# Altium schematic sheet LED Dice.SchDoc
size A; SheetNumber: 1; SheetTotal: 2
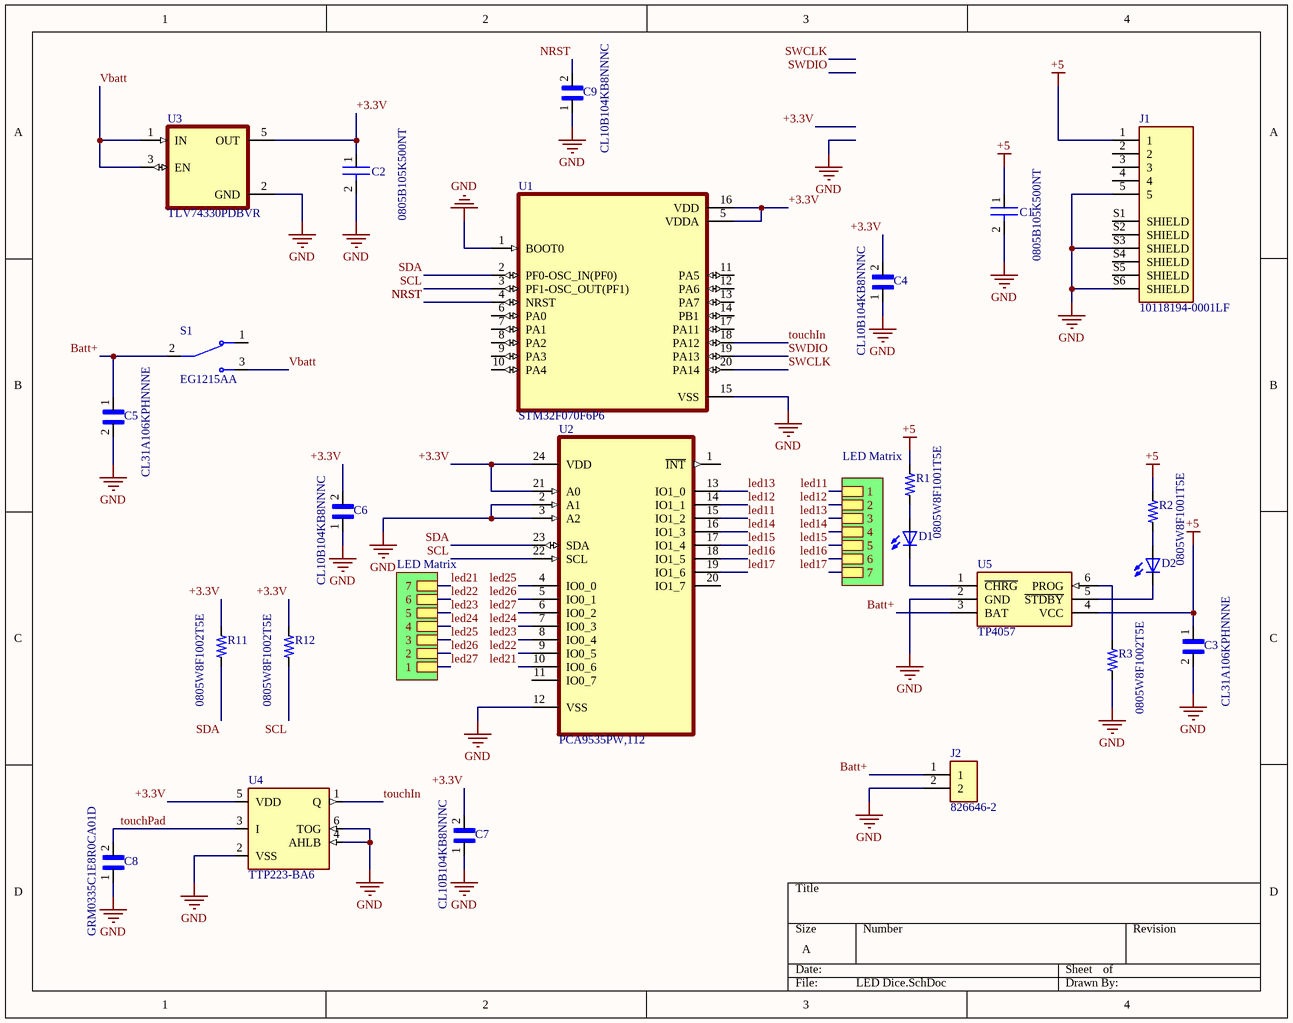
[diagram p0: LED Dice.SchDoc]

## Parts
C1  0805B105K500NT  [CAPC2012X135N]
C2  0805B105K500NT  [CAPC2012X135N]
C3  CL31A106KPHNNNE  [CAPC3216X180N]
C4  CL10B104KB8NNNC  [CAPC1608X90N]
C5  CL31A106KPHNNNE  [CAPC3216X180N]
C6  CL10B104KB8NNNC  [CAPC1608X90N]
C7  CL10B104KB8NNNC  [CAPC1608X90N]
C8  GRM0335C1E8R0CA01D  [CAPC1608X90N]
C9  CL10B104KB8NNNC  [CAPC1608X90N]
D1  LTST-C171KRKT  [DIOC200X125X110]  (value not drawn)
D2  LTST-C171KRKT  [DIOC200X125X110]  (value not drawn)
J1  10118194-0001LF  [AMPHENOL_10118194-0001LF]
J2  826646-2  [TE_826646-2]
R1  0805W8F1001T5E  [RESC2012X65N]
R2  0805W8F1001T5E  [RESC2012X65N]
R3  0805W8F1002T5E  [RESC2012X65N]
R11  0805W8F1002T5E  [RESC2012X65N]
R12  0805W8F1002T5E  [RESC2012X65N]
S1  EG1215AA  [SW_EG1215AA]
U1  STM32F070F6P6  [SOP65P640X120-20N]
U2  PCA9535PW,112  [SOP65P640X110-24N]
U3  TLV74330PDBVR  [SOT95P280X145-5N]
U4  TTP223-BA6  [SOT23-6]
U5  TP4057  [SOT23-6]

## Sub-sheets
LED Matrix = LED Matrix.SchDoc: 1, 2, 3, 4, 5, 6, 7
LED Matrix = LED Matrix.SchDoc: 1, 2, 3, 4, 5, 6, 7

## Nets
+5: C1.1(A) C3.1 J1.1 R1.2 R2.2 U5.4(VCC)
GND: C1.2(C) C2.2(C) C3.2 C4.1 C5.2 C6.1 C7.1 C8.1 C9.1 J1.5 J1.S3(SHIELD) J1.S6(SHIELD) J2.2 R3.1 U1.1(BOOT0) U1.15(VSS) U2.2(A1) U2.3(A2) U2.12(VSS) U3.2(GND) U4.2(VSS) U4.4(AHLB) U4.6(TOG) U5.2(GND)
+3.3V: C2.1(A) C4.2 C6.2 C7.2 R11.2 R12.2 U1.5(VDDA) U1.16(VDD) U2.21(A0) U2.24(VDD) U3.5(OUT) U4.5(VDD)
Batt+: C5.1 J2.1 S1.2 U5.3(BAT)
led11: U2.15(IO1_2) ; sheet LED Matrix/1
led12: U2.14(IO1_1) ; sheet LED Matrix/2
led13: U2.13(IO1_0) ; sheet LED Matrix/3
led14: U2.16(IO1_3) ; sheet LED Matrix/4
led15: U2.17(IO1_4) ; sheet LED Matrix/5
led16: U2.18(IO1_5) ; sheet LED Matrix/6
led17: U2.19(IO1_6) ; sheet LED Matrix/7
led21: U2.10(IO0_6) ; sheet LED Matrix/7
led22: U2.9(IO0_5) ; sheet LED Matrix/6
led23: U2.8(IO0_4) ; sheet LED Matrix/5
led24: U2.7(IO0_3) ; sheet LED Matrix/4
led25: U2.4(IO0_0) ; sheet LED Matrix/3
led26: U2.5(IO0_1) ; sheet LED Matrix/2
led27: U2.6(IO0_2) ; sheet LED Matrix/1
NRST: C9.2 U1.4(NRST)
SCL: R12.1 U1.3(PF1-OSC_OUT(PF1)) U2.22(SCL)
SDA: R11.1 U1.2(PF0-OSC_IN(PF0)) U2.23(SDA)
SWCLK: U1.20(PA14)
SWDIO: U1.19(PA13)
touchIn: U1.18(PA12) U4.1(Q)
touchPad: C8.2 U4.3(I)
Vbatt: S1.3 U3.1(IN) U3.3(EN)
NetD1_NEG: D1.NEG U5.1(~{CHRG})
NetD1_POS: D1.POS R1.1
NetD2_NEG: D2.NEG U5.5(~{STDBY})
NetD2_POS: D2.POS R2.1
NetR3_2: R3.2 U5.6(PROG)

Not connected (* = marked no-connect by the designer): J1 2 3 4 S1(SHIELD) S2(SHIELD) S4(SHIELD) S5(SHIELD); S1 1; U1 6(PA0) 7(PA1) 8(PA2) 9(PA3) 10(PA4) 11(PA5) 12(PA6) 13(PA7) 14(PB1) 17(PA11); U2 1(~{INT}) 11(IO0_7) 20(IO1_7)

## Library data of the parts
C1 C2 = 0805B105K500NT: 50V 1uF X7R ±10% 0805 Multilayer Ceramic Capacitors MLCC - SMD/SMT ROHS
C3 C5 = CL31A106KPHNNNE: Cap Ceramic 10uF 10VDC X5R 10% SMD 1206 Embossed T/R; Package: None; Price: None; Value: *; MP: CL31A106KPHNNNE; Availability: Unavailable
C4 C6 C7 C9 = CL10B104KB8NNNC: 0.1ÂµF Â±10% 50V Ceramic Capacitor X7R 0603 _1608 Metric_; MF: Samsung Electro-Mechanics; Price: None; MP: CL10B104KB8NNNC; SnapEDA_Link: https://www.snapeda.com/parts/CL10B104KB8NNNC/Samsung%20Electro-Mechanics/view-part/3598309/?ref=snap; Availability: Unavailable; Package: 0603 Samsung; Value: *
C8 = GRM0335C1E8R0CA01D: SMD Capacitor C0G(EIA) with Capacitance: 8.0pF Tol. 0.25pF. Rated Voltage: 25Vdc; Package: None; Price: None; Value: *; MP: GRM0335C1E8R0CA01D; Availability: Unavailable
D1 D2 = LTST-C171KRKT: Red LED  0805 _2012 Indication 631nm - Discrete 2V 0805 _2012 Metric_; MF: Lite-On Inc.; MP: LTST-C171KRKT; Package: 0805 Lite-On; Price: None; Availability: Unavailable; SnapEDA_Link: https://www.snapeda.com/parts/LTST-C171KRKT/Lite-On%20Inc./view-part/357775/?ref=snap; Value: *
J1 = 10118194-0001LF: Micro USB, Input Output Connectors, B TYPE RECEPTACLE with flange; MF: Amphenol ICC; Package: None; Price: None; Check_prices: https://www.snapeda.com/parts/10118194-0001LF/Amphenol+FCI/view-part/?ref=eda; Value: *; SnapEDA_Link: https://www.snapeda.com/parts/10118194-0001LF/Amphenol+FCI/view-part/?ref=snap; MP: 10118194-0001LF; Availability: In Stock; Purchase-URL: https://pricing.snapeda.com/search/part/10118194-0001LF/?ref=eda
J2 = 826646-2: Conn Unshrouded Header HDR 2 POS 2.54mm Solder ST Thru-Hole; Centerline_Pitch: 2.54 mm[.1 in]; Product_Type: Connector; MF: TE Connectivity; Number_of_Positions: 2; Availability: Good; Price: None; EU_RoHS_Compliance: Compliant; Value: *; DigiKey-Purchase-URL: https://snapeda.com/shop?store=DigiKey&id=470405; Mouser-Purchase-URL: https://snapeda.com/shop?store=Mouser&id=470405; SnapEDA_Link: https://www.snapeda.com/parts/826646-2/TE%20Connectivity%20AMP%20Connectors/view-part/470405/?ref=snap; Package: None; MP: 826646-2
R1 R2 = 0805W8F1001T5E: 125mW Thick Film Resistors 150V ±100ppm/℃ ±1% 1kΩ 0805 Chip Resistor - Surface Mount ROHS; Supplier 1: Mouser; Supplier Part Number 1: 303-0805W8F1001T5E
R3 R11 R12 = 0805W8F1002T5E: 125mW Thick Film Resistors 150V ±100ppm/℃ ±1% 10kΩ 0805 Chip Resistor - Surface Mount ROHS
S1 = EG1215AA: Slide Switch SPDT Surface Mount, Right Angle; MF: E-Switch; Check_prices: https://www.snapeda.com/parts/EG1215AA/E-Switch/view-part/?ref=eda; SnapEDA_Link: https://www.snapeda.com/parts/EG1215AA/E-Switch/view-part/?ref=snap; Value: *; Purchase-URL: https://pricing.snapeda.com/search/part/EG1215AA/?ref=eda; Package: None; MP: EG1215AA
U1 = STM32F070F6P6: ARMÂ® CortexÂ®-M0 STM32F0 Microcontroller IC 32-Bit Single-Core 48MHz 32KB (32K x 8) FLASH 20-TSSOP; MF: STMicroelectronics; SnapEDA_Link: https://www.snapeda.com/parts/STM32F070F6P6/STMicroelectronics/view-part/?ref=snap; Package: TSSOP-20 STMicroelectronics; Value: *; MP: STM32F070F6P6; Check_prices: https://www.snapeda.com/parts/STM32F070F6P6/STMicroelectronics/view-part/?ref=eda
U2 = PCA9535PW,112: 16-bit I2C-bus and SMBus, low power I/O port with interrupt; Package: None; Price: None; Value: *; MP: PCA9535PW,112; Availability: Unavailable
U3 = TLV74330PDBVR: 300-mA low-IQ low-dropout (LDO) voltage regulator with enable 5-SOT-23 -40 to 125; MF: Texas Instruments; Package: SOT-23-5 Texas Instruments; Check_prices: https://www.snapeda.com/parts/TLV74330PDBVR/Texas%20Instruments/view-part/2878367/?ref=eda; Price: None; SnapEDA_Link: https://www.snapeda.com/parts/TLV74330PDBVR/Texas%20Instruments/view-part/2878367/?ref=snap; Value: *; MP: TLV74330PDBVR; Purchase-URL: https://pricing.snapeda.com/search/part/TLV74330PDBVR/?ref=eda; Availability: Warning
U4 = TTP223-BA6: <b>DÃ©tecteur</b> de Touches Tactiles IC<p> Doc constructeur <a href="http://geii/magasin/pdf/TTP223-BA6.pdf" title="Enlarge picture"> <img src="http://geii/magasin/images/pdf.jpg"></a><p> <b>GEII/IUT ANGERS</b>; MF: tontek; Value: *; SnapEDA_Link: https://www.snapeda.com/parts/TTP223-BA6/TONTEK/view-part/?ref=snap; Price: None; Availability: Not in stock; Package: None; MP: TTP223-BA6; Check_prices: https://www.snapeda.com/parts/TTP223-BA6/TONTEK/view-part/?ref=eda
U5 = TP4057: <b>500mA linear li-ion battery charger</b><p> tp4057 actual charge current to 500ma, dual-lamp indication, reverse battery protection.<br> Alternative to MAX1551 or MAX1555 (not compatible!)<p> Datasheet from TP micro: <br> http://www.tpmicro.com/datasheet/TP4057Ver1.0_preview.pdf <br> http://www.tp-asic.com/te_product_a/2009-05-20/33.chtml; MF: toppower; SnapEDA_Link: https://www.snapeda.com/parts/TP4057/Top+Power/view-part/?ref=snap; Package: None; MP: TP4057; Check_prices: https://www.snapeda.com/parts/TP4057/Top+Power/view-part/?ref=eda; Price: None; Value: *; Availability: Not in stock